# Altium schematic sheet MD015A.SchDoc
size 431 x 279 mm; Date: Not shown in title block; ApprovedBy: Not shown in title block; CheckedBy: Not shown in title block; Author: Not shown in title block; CompanyName: Not shown in title block; Engineer: Not shown in title block; Organization: Not shown in title block; Address1: Not shown in title block; Address2: Not shown in title block; Address3: Not shown in title block; Address4: Not shown in title block; DocumentNumber: 3; Revision: Use project parameter SCH_Rev; SheetNumber: 3; SheetTotal: 4; PageSetup: Record=PageOptions|CenterHorizontal=True|CenterVertical=True|PrintScale=1.00|XCorrection=1.00|YCorrection=1.00|PrintKind=0|BorderSize=5000000|LeftOffset=0|BottomOffset=0|Orientation=2|PaperLength=1000|PaperWidth=1000|Scale=100|PaperSource=15|PrintQuality=600|MediaType=1|DitherType=10|PaperKind=Letter|PrintScaleMode=1; CurrentTime: Not shown in title block; CurrentDate: Not shown in title block; Time: Not shown in title block; DocumentFullPathAndName: Not shown in title block; DocumentName: Not shown in title block; ModifiedDate: Not shown in title block; ImagePath: Not shown in title block
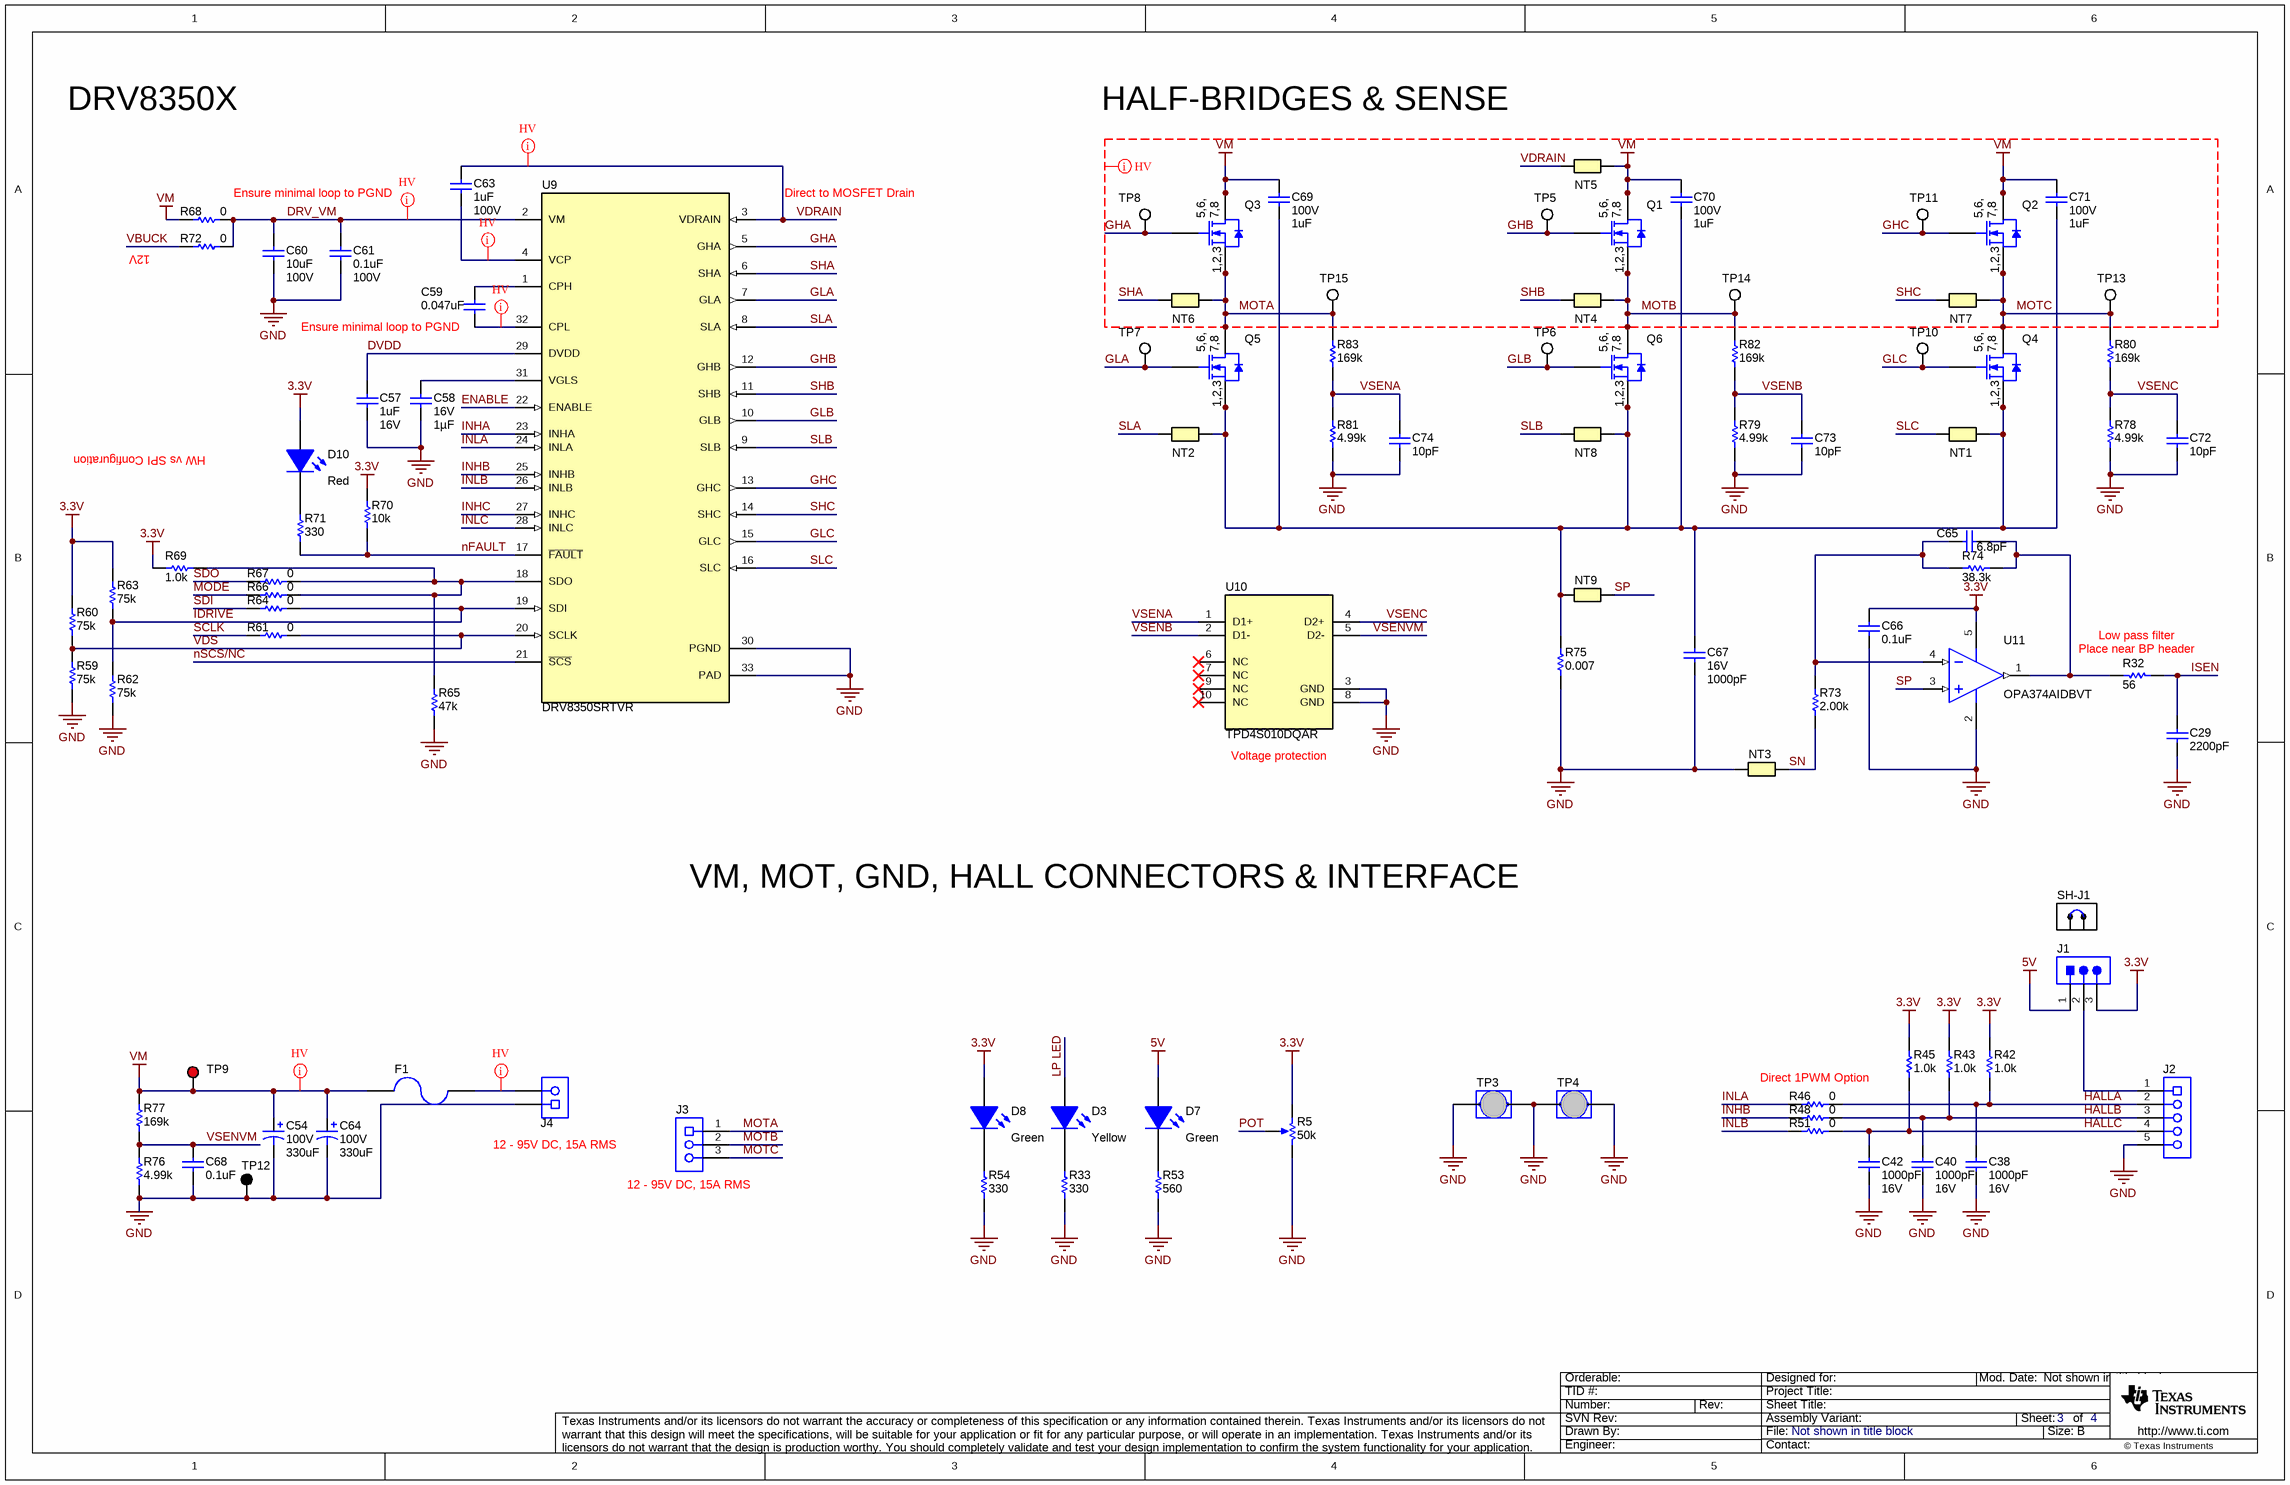
[diagram p0: MD015A.SchDoc]

## Parts
C29  ValueDisplayed: 2200pF  [0603L]  (hidden comment: GRM188R71C222KA01D)
C38  ValueDisplayed: 1000pF  VDC_V: 16V  [0603L]  (hidden comment: 885012206034)
C40  ValueDisplayed: 1000pF  VDC_V: 16V  [0603L]  (hidden comment: 885012206034)
C42  ValueDisplayed: 1000pF  VDC_V: 16V  [0603L]  (hidden comment: 885012206034)
C54  VDC_V: 100V  ValueDisplayed: 330uF  [SM_RADIAL_K16]  (hidden comment: EEV-FK2A331M)
C57  ValueDisplayed: 1uF  VDC_V: 16V  [0603L]  (hidden comment: EMK107B7105KA-T)
C58  VDC_V: 16V  ValueDisplayed: 1µF  [0603]  (hidden comment: CL10B105KO8VPNC)
C59  ValueDisplayed: 0.047uF  [0805_HV]  (hidden comment: C2012X7R2A473K125AA)
C60  ValueDisplayed: 10uF  VDC_V: 100V  [2220_280]  (hidden comment: CGA9N3X7S2A106K230KE)
C61  ValueDisplayed: 0.1uF  VDC_V: 100V  [0805]  (hidden comment: C2012X7R2A104K125AA)
C63  ValueDisplayed: 1uF  VDC_V: 100V  [1206_180L]  (hidden comment: CL31B105KCHNNNE)
C64  VDC_V: 100V  ValueDisplayed: 330uF  [SM_RADIAL_K16]  (hidden comment: EEV-FK2A331M)
C65  ValueDisplayed: 6.8pF  [0603L]  (hidden comment: 06035A6R8CAT2A)
C66  ValueDisplayed: 0.1uF  [0603L]  (hidden comment: C0603C104J4RACTU)
C67  VDC_V: 16V  ValueDisplayed: 1000pF  [0603L]  (hidden comment: 885012206034)
C68  ValueDisplayed: 0.1uF  [0603L]  (hidden comment: C0603C104J4RACTU)
C69  VDC_V: 100V  ValueDisplayed: 1uF  [1206_180]  (hidden comment: CL31B105KCHNNNE)
C70  VDC_V: 100V  ValueDisplayed: 1uF  [1206_180]  (hidden comment: CL31B105KCHNNNE)
C71  VDC_V: 100V  ValueDisplayed: 1uF  [1206_180]  (hidden comment: CL31B105KCHNNNE)
C72  ValueDisplayed: 10pF  [0603L]  (hidden comment: C0603C100F5GAC7867)
C73  ValueDisplayed: 10pF  [0603L]  (hidden comment: C0603C100F5GAC7867)
C74  ValueDisplayed: 10pF  [0603L]  (hidden comment: C0603C100F5GAC7867)
D3  value Yellow  [LED_LTST-C170]  (hidden comment: LTST-C170KSKT)
D7  value Green  [LTST-C170KGKT_Green]  (hidden comment: LTST-C170KGKT)
D8  value Green  [LTST-C170KGKT_Green]  (hidden comment: LTST-C170KGKT)
D10  value Red  [LED_LTST-C170_Red]  (hidden comment: LTST-C170KRKT)
F1  0463030.ER  [Fuse_0463]  (value not drawn)
J1  22284030  [Molex_0022284030]  (value not drawn)
J2  1792892  [Phoenix_1792892]  (value not drawn)
J3  1904150  [Phoenix_1904150]  (value not drawn)
J4  1902547  [Phoenix_1902547]  (value not drawn)
NT1  Net-Tie  [Net-Tie_20milWide_60milLong]  (value not drawn)  (net tie, no BOM)
NT2  Net-Tie  [Net-Tie_20milWide_60milLong]  (value not drawn)  (net tie, no BOM)
NT3  Net-Tie  [Net-Tie_20milWide_60milLong]  (value not drawn)  (net tie, no BOM)
NT4  Net-Tie  [Net-Tie_20milWide_60milLong]  (value not drawn)  (net tie, no BOM)
NT5  Net-Tie  [Net-Tie_50milWide_30milLong]  (value not drawn)  (net tie, no BOM)
NT6  Net-Tie  [Net-Tie_20milWide_60milLong]  (value not drawn)  (net tie, no BOM)
NT7  Net-Tie  [Net-Tie_20milWide_60milLong]  (value not drawn)  (net tie, no BOM)
NT8  Net-Tie  [Net-Tie_20milWide_60milLong]  (value not drawn)  (net tie, no BOM)
NT9  Net-Tie  [Net-Tie_20milWide_60milLong]  (value not drawn)  (net tie, no BOM)
Q1  CSD19532Q5B  [DNK0008A]  (value not drawn)
Q2  CSD19532Q5B  [DNK0008A]  (value not drawn)
Q3  CSD19532Q5B  [DNK0008A]  (value not drawn)
Q4  CSD19532Q5B  [DNK0008A]  (value not drawn)
Q5  CSD19532Q5B  [DNK0008A]  (value not drawn)
Q6  CSD19532Q5B  [DNK0008A]  (value not drawn)
R5  value 50k  [Bourns_3352T]  (hidden comment: 3352T-1-503LF)
R32  value 56  [0603L]  (hidden comment: CRCW060356R0JNEA)
R33  ValueDisplayed: 330  [0603L]  (hidden comment: CRCW0603330RJNEA)
R42  ValueDisplayed: 1.0k  [0603L]  (hidden comment: RCA06031K00JNEA)
R43  ValueDisplayed: 1.0k  [0603L]  (hidden comment: RCA06031K00JNEA)
R45  ValueDisplayed: 1.0k  [0603L]  (hidden comment: RCA06031K00JNEA)
R46  ValueDisplayed: 0  [0603L]  (hidden comment: CRCW06030000Z0EA)
R48  ValueDisplayed: 0  [0603L]  (hidden comment: CRCW06030000Z0EA)
R51  ValueDisplayed: 0  [0603L]  (hidden comment: CRCW06030000Z0EA)
R53  ValueDisplayed: 560  [0603L]  (hidden comment: RG1608P-561-B-T5)
R54  ValueDisplayed: 330  [0603L]  (hidden comment: CRCW0603330RJNEA)
R59  ValueDisplayed: 75k  [0603L]  (hidden comment: CRCW060375K0JNEA)
R60  ValueDisplayed: 75k  [0603L]  (hidden comment: CRCW060375K0JNEA)
R61  ValueDisplayed: 0  [0603L]  (hidden comment: CRCW06030000Z0EA)
R62  ValueDisplayed: 75k  [0603L]  (hidden comment: CRCW060375K0JNEA)
R63  ValueDisplayed: 75k  [0603L]  (hidden comment: CRCW060375K0JNEA)
R64  ValueDisplayed: 0  [0603L]  (hidden comment: CRCW06030000Z0EA)
R65  ValueDisplayed: 47k  [0603L]  (hidden comment: CRCW060347K0JNEA)
R66  ValueDisplayed: 0  [0603L]  (hidden comment: CRCW06030000Z0EA)
R67  ValueDisplayed: 0  [0603L]  (hidden comment: CRCW06030000Z0EA)
R68  ValueDisplayed: 0  [1206]  (hidden comment: RC1206JR-070RL)
R69  ValueDisplayed: 1.0k  [0603L]  (hidden comment: RCA06031K00JNEA)
R70  ValueDisplayed: 10k  [0603L]  (hidden comment: RC0603JR-0710KL)
R71  ValueDisplayed: 330  [0603L]  (hidden comment: CRCW0603330RJNEA)
R72  ValueDisplayed: 0  [1206]  (hidden comment: RC1206JR-070RL)
R73  ValueDisplayed: 2.00k  [0603L]  (hidden comment: RC0603FR-072KL)
R74  ValueDisplayed: 38.3k  [0603L]  (hidden comment: CRCW060338K3FKEA)
R75  ValueDisplayed: 0.007  [CRE2512-R5_R9]  (hidden comment: CRE2512-FZ-R007E-3)
R76  ValueDisplayed: 4.99k  [0603L]  (hidden comment: RC0603FR-074K99L)
R77  ValueDisplayed: 169k  [0603_HV]  (hidden comment: RC0603FR-07169KL)
R78  ValueDisplayed: 4.99k  [0603L]  (hidden comment: RC0603FR-074K99L)
R79  ValueDisplayed: 4.99k  [0603L]  (hidden comment: RC0603FR-074K99L)
R80  ValueDisplayed: 169k  [0603_HV]  (hidden comment: RC0603FR-07169KL)
R81  ValueDisplayed: 4.99k  [0603L]  (hidden comment: RC0603FR-074K99L)
R82  ValueDisplayed: 169k  [0603_HV]  (hidden comment: RC0603FR-07169KL)
R83  ValueDisplayed: 169k  [0603_HV]  (hidden comment: RC0603FR-07169KL)
SH-J1  SNT-100-BK-G  [SNT-100-BK-G]  (value not drawn)
TP3  D3082-05  [Harwin_D3082-05]  (value not drawn)
TP4  D3082-05  [Harwin_D3082-05]  (value not drawn)
TP5  5002  [Keystone5002]  (value not drawn)
TP6  5002  [Keystone5002]  (value not drawn)
TP7  5002  [Keystone5002]  (value not drawn)
TP8  5002  [Keystone5002]  (value not drawn)
TP9  5000  [Keystone5000]  (value not drawn)
TP10  5002  [Keystone5002]  (value not drawn)
TP11  5002  [Keystone5002]  (value not drawn)
TP12  5001  [Keystone5001]  (value not drawn)
TP13  5002  [Keystone5002]  (value not drawn)
TP14  5002  [Keystone5002]  (value not drawn)
TP15  5002  [Keystone5002]  (value not drawn)
U9  DRV8350SRTVR  [RTV0032E]
U10  TPD4S010DQAR  [DQA0010A]
U11  OPA374AIDBVT  [DBV0005A_L]

## Nets
3.3V: C66.1 D8.1(A) D10.1(A) J1.3 R5.3(CW) R42.2 R43.2 R45.2 R60.2 R63.2 R69.2 R70.2 U11.5(V+)
5V: D7.1(A) J1.1
GND: C29.2 C38.2 C40.2 C42.2 C54.2(-) C57.2 C58.2 C60.2 C61.2 C64.2(-) C66.2 C67.2 C68.2 C72.2 C73.2 C74.2 J2.5 J4.1 NT3.1 R5.1(CCW) R33.1 R53.1 R54.1 R59.1 R62.1 R65.1 R75.1 R76.1 R78.1 R79.1 R81.1 TP3.1 TP3.2 TP4.1 TP4.2 TP12.1 U9.30(PGND) U9.33(PAD) U10.3(GND) U10.8(GND) U11.2(V-)
VM: C54.1(+) C64.1(+) C69.1 C70.1 C71.1 F1.2 NT5.2 Q1.5(D) Q1.6(D) Q1.7(D) Q1.8(D) Q1.9(D) Q2.5(D) Q2.6(D) Q2.7(D) Q2.8(D) Q2.9(D) Q3.5(D) Q3.6(D) Q3.7(D) Q3.8(D) Q3.9(D) R68.1 R77.2 TP9.1
DRV_VM: C60.1 C61.1 R68.2 R72.2 U9.2(VM)
DVDD: C57.1 U9.29(DVDD)
ENABLE: U9.22(ENABLE)
GHA: Q3.4(G) TP8.1 U9.5(GHA)
GHB: Q1.4(G) TP5.1 U9.12(GHB)
GHC: Q2.4(G) TP11.1 U9.13(GHC)
GLA: Q5.4(G) TP7.1 U9.7(GLA)
GLB: Q6.4(G) TP6.1 U9.10(GLB)
GLC: Q4.4(G) TP10.1 U9.15(GLC)
HALLA: C38.1 J2.2 R42.1 R46.2
HALLB: C40.1 J2.3 R43.1 R48.2
HALLC: C42.1 J2.4 R45.1 R51.2
IDRIVE: R62.2 R63.1 R64.2 U9.19(SDI)
INHA: U9.23(INHA)
INHB: R48.1 U9.25(INHB)
INHC: U9.27(INHC)
INLA: R46.1 U9.24(INLA)
INLB: R51.1 U9.26(INLB)
INLC: U9.28(INLC)
ISEN: C29.1 R32.1
LP LED: D3.1(A)
MODE: R66.1
MOTA: J3.1 NT6.2 Q3.1(S) Q3.2(S) Q3.3(S) Q5.5(D) Q5.6(D) Q5.7(D) Q5.8(D) Q5.9(D) R83.2 TP15.1
MOTB: J3.2 NT4.2 Q1.1(S) Q1.2(S) Q1.3(S) Q6.5(D) Q6.6(D) Q6.7(D) Q6.8(D) Q6.9(D) R82.2 TP14.1
MOTC: J3.3 NT7.2 Q2.1(S) Q2.2(S) Q2.3(S) Q4.5(D) Q4.6(D) Q4.7(D) Q4.8(D) Q4.9(D) R80.2 TP13.1
nFAULT: R70.1 R71.1 U9.17(~{FAULT})
nSCS/NC: U9.21(~{SCS})
POT: R5.2(WIPER)
SCLK: R61.1
SDI: R64.1
SDO: R67.1
SHA: NT6.1 U9.6(SHA)
SHB: NT4.1 U9.11(SHB)
SHC: NT7.1 U9.14(SHC)
SLA: NT2.1 U9.8(SLA)
SLB: NT8.1 U9.9(SLB)
SLC: NT1.1 U9.16(SLC)
SN: NT3.2 R73.2
SP: NT9.2 U11.3(IN+)
VBUCK: R72.1
VDRAIN: C63.1 NT5.1 U9.3(VDRAIN)
VDS: R59.2 R60.1 R61.2 U9.20(SCLK)
VSENA: C74.1 R81.2 R83.1 U10.1(D1+)
VSENB: C73.1 R79.2 R82.1 U10.2(D1-)
VSENC: C72.1 R78.2 R80.1 U10.4(D2+)
VSENVM: C68.1 R76.2 R77.1 U10.5(D2-)
NetC58_1: C58.1 U9.31(VGLS)
NetC59_1: C59.1 U9.1(CPH)
NetC59_2: C59.2 U9.32(CPL)
NetC63_2: C63.2 U9.4(VCP)
NetC65_1: C65.1 R32.2 R74.1 U11.1(OUT)
NetC65_2: C65.2 R73.1 R74.2 U11.4(IN-)
NetC67_1: C67.1 C69.2 C70.2 C71.2 NT1.2 NT2.2 NT8.2 NT9.1 Q4.1(S) Q4.2(S) Q4.3(S) Q5.1(S) Q5.2(S) Q5.3(S) Q6.1(S) Q6.2(S) Q6.3(S) R75.2
NetD3_2: D3.2(K) R33.2
NetD7_2: D7.2(K) R53.2
NetD8_2: D8.2(K) R54.2
NetD10_2: D10.2(K) R71.2
NetF1_1: F1.1 J4.2
NetJ1_2: J1.2 J2.1
NetR65_2: R65.2 R66.2 R67.2 R69.1 U9.18(SDO)

Not connected (* = marked no-connect by the designer): U10 6(NC)* 7(NC)* 9(NC)* 10(NC)*

## Layout directives
net class HV: DRV_VM, GHA, GHB, GHC, MOTA, MOTB, MOTC, NetC59_2, NetC63_2, NetF1_1, SHA, SHB, SHC, VDRAIN, VM

## Notes on the sheet
- DRV8350X
- HALF-BRIDGES & SENSE
- (near R68) Ensure minimal loop to PGND
- Direct to MOSFET Drain
- 12V
- (near C59) Ensure minimal loop to PGND
- HW vs SPI Configuration
- (near R32) Low pass filter
- (near R32) Place near BP header
- (near U10) Voltage protection
- VM, MOT, GND, HALL CONNECTORS & INTERFACE
- Direct 1PWM Option
- (near J4) 12 - 95V DC, 15A RMS
- (near J3) 12 - 95V DC, 15A RMS
- Drawn By:
- SVN Rev:
- Number:
- TID #:
- Orderable:
- Rev:
- Sheet Title:
- File:
- Project Title:
- Designed for:
- Assembly Variant:
- Mod. Date:
- Sheet:
- Size:
- of
- B
- http://www.ti.com
- Texas Instruments and/or its licensors do not warrant the accuracy or completeness of this specification or any information contained therein. Texas Instruments and/or its licensors do not warrant that this design will meet the specifications, will be suitable for your application or fit for any particular purpose, or will operate in an implementation. Texas Instruments and/or its licensors do not warrant that the design is production worthy. You should completely validate and test your design implementation to confirm the system functionality for your application.
- Engineer:
- Contact:
- © Texas Instruments
- (in symbol CMP-0000958-3) 5,6,; 7,8; 1,2,3

## Library data of the parts
C29 = CMP-0007387-4: CAP, CERM, 2200 pF, 16 V, +/- 10%, X7R, 0603; Manufacturer: MuRata; Polarized: N; Value: 2200pF; U/M: EA; Cap_F: 2.2nF; Value1: Unknown; VDC_V: 16V; TaMin_C: -55°C; TaMax_C: 125°C; Cap_Case: 0603; SizeArea_mm2: 1.28; SizeAreaWB_mm2: 4.68; SizeX_mm: 1.6; SizeY_mm: 0.8; SizeZ_mm: 1; AEC Category: Q200; CompType: Capacitor; PartNumber: GRM188R71C222KA01D; PackageReference: 0603; RoHS: Y; Tolerance_%: 10%; Value2: 16V; MountType: SMT; Technology: Ceramic; TempCo: X7R; Published: 2008-06-19; Publisher: Texas Instruments; LatestRevisionDate: 2017-03-09; ComponentLink1Description: Datasheet link; ComponentLink1URL: http://search.murata.co.jp/Ceramy/PnsearchViewAction.do?HnOFG=ON&HnNFG=ON&SEL_CNT=50&sLang=en&sKey=GRM188R71C222KA01D&x=9&y=9&search=startwith; Supplier 1: Digi-Key; Supplier Part Number 1: GRM188R71C222KA01D-ND; Supplier 2: Mouser; Supplier Part Number 2: 81-GRM188R71C222KA1D; AEC Qualified: ?
C38 C40 C42 C67 = CMP-0006826-4: CAP, CERM, 1000 pF, 16 V, +/- 10%, X7R, 0603; Manufacturer: Wurth Elektronik; TaMin_C: -55°C; Polarized: N; SizeAreaWB_mm2: 4.68; Value1: Unknown; U/M: EA; Value: 1000pF; TaMax_C: 125°C; SizeZ_mm: 1; SizeX_mm: 1.6; SizeY_mm: 0.8; Cap_Case: 0603; SizeArea_mm2: 1.28; Cap_F: 1nF; AEC Category: Q200; Publisher: Texas Instruments; TempCo: X7R; Published: 2008-06-19; RoHS: Y; MountType: SMT; Supplier 1: Mouser; PackageReference: 0603; Tolerance_%: 10%; Value2: 16V; CompType: Capacitor; LatestRevisionDate: 2017-03-09; PartNumber: 885012206034; AEC Qualified: N; ComponentLink1Description: Datasheet link; AEC Grade: N/A; Supplier Part Number 1: 710-885012206034; Technology: Ceramic; ComponentLink1URL: http://katalog.we-online.de/pbs/datasheet/885012206034.pdf
C54 C64 = CMP-0011224-2: CAP, AL, 330 uF, 100 V, +/- 20%, 0.153 ohm, AEC-Q200 Grade 2, SMD; Manufacturer: Panasonic; TaMin_C: -55°C; ESR_ohm: 0.153; Polarized: Y; SizeAreaWB_mm2: 483; U/M: EA; Value: 330uF; TaMax_C: 105°C; SizeZ_mm: 16.5; SizeX_mm: 21; SizeY_mm: 19; Cap_Case: K16; SizeArea_mm2: 399; CompType: Capacitor; Cap_F: 330µF; IRMS_A: 917mA; AEC Grade: 2; AEC Category: Q200; Supplier Part Number 2: 667-EEV-FK2A331M; Publisher: Texas Instruments; Supplier 2: Mouser; RoHS: Y; Value1: 0.153 ohm; MountType: SMT; Supplier 1: Digi-Key; PackageReference: SMT Radial K16; Tolerance_%: 20%; Value2: 100V; LatestRevisionDate: 2017-03-09; PartNumber: EEV-FK2A331M; AEC Qualified: Y; Series: FK; ComponentLink1Description: Datasheet link; Supplier Part Number 1: PCE3505CT-ND; Technology: AL; ComponentLink1URL: https://industrial.panasonic.com/cdbs/www-data/pdf/RDE0000/ABA0000C1181.pdf
C57 = CMP-0007120-4: CAP, CERM, 1 uF, 16 V, +/- 10%, X7R, 0603; Manufacturer: Taiyo Yuden; TaMin_C: -55°C; Polarized: N; SizeAreaWB_mm2: 4.68; Value1: Unknown; U/M: EA; Value: 1uF; TaMax_C: 85°C; SizeZ_mm: 1; SizeX_mm: 1.6; SizeY_mm: 0.8; Cap_Case: 0603; SizeArea_mm2: 1.28; Cap_F: 1µF; AEC Category: Q200; Publisher: Texas Instruments; TempCo: X7R; Published: 2008-06-19; RoHS: Y; MountType: SMT; Supplier 1: Farnell; PackageReference: 0603; Tolerance_%: 10%; Value2: 16V; CompType: Capacitor; LatestRevisionDate: 2017-03-09; PartNumber: EMK107B7105KA-T; AEC Qualified: ?; ComponentLink1Description: Datasheet link; Supplier Part Number 1: 1683647; Technology: Ceramic; ComponentLink1URL: http://www.yuden.co.jp/ut/product/pdf/djmk_e.pdf
C58 = CMP-0085302-1: CAP, CERM, 1 µF, 16 V,+/- 10%, X7R, AEC-Q200 Grade 1, 0603; Manufacturer: Samsung Electro-Mechanics; TaMax_C: 125°C; AEC Grade: 1; SizeAreaWB_mm2: 4.68; AEC Category: Q200; SizeY_mm: 0.8; U/M: EA; SizeArea_mm2: 1.28; TaMin_C: -55°C; Value: 1uF; SizeX_mm: 1.6; AEC Qualified: Y; Polarized: N; PartNumber: CL10B105KO8VPNC; Tolerance_%: 10%; PackageReference: 0603; Value2: 16V; MountType: SMT; ComponentLink1URL: http://www.samsungsem.com/kr/support/product-search/mlcc/__icsFiles/afieldfile/2018/05/28/CL10B105KO8VPNC.pdf; SizeZ_mm: 1; Technology: Ceramic; Cap_Case: 0603; Cap_F: 1µF; CompType: Capacitor; RoHS: Y; ComponentLink1Description: Datasheet link; TempCo: X7R
C59 = CMP-0007887-2: CAP, CERM, 0.047 uF, 100 V, +/- 10%, X7R, 0805; Manufacturer: TDK; Polarized: N; U/M: EA; Cap_F: 47nF; ESR_ohm: 0.049089; Value1: 0.049089 ohm; VDC_V: 100V; IRMS_A: 963.171mA; TaMin_C: -55°C; TaMax_C: 125°C; Cap_Case: 0805; AEC Category: Q200; SizeArea_mm2: 2.5; SizeAreaWB_mm2: 6.75; SizeX_mm: 2; SizeY_mm: 1.25; SizeZ_mm: 1.45; CompType: Capacitor; Value: 0.047uF; PartNumber: C2012X7R2A473K125AA; PackageReference: 0805; RoHS: Y; Tolerance_%: 10%; Value2: 100V; MountType: SMT; Technology: Ceramic; TempCo: X7R; Published: 2008-06-19; Publisher: Texas Instruments; LatestRevisionDate: 2017-03-09; ComponentLink1Description: Datasheet link; ComponentLink1URL: https://product.tdk.com/en/search/capacitor/ceramic/mlcc/info?part_no=C2012X7R2A473K125AA; Supplier 1: Digi-Key; Supplier Part Number 1: 445-2276-1-ND; Supplier 2: Mouser; Supplier Part Number 2: 810-C2012X7R2A473K125AA; AEC Qualified: N; AEC Grade: N/A
C60 = CMP-0064964-2: CAP, CERM, 10 uF, 100 V,+/- 10%, X7S, AEC-Q200 Grade 1, 2220; Manufacturer: TDK; TaMin_C: -55°C; Polarized: N; SizeAreaWB_mm2: 53.9; Value1: Unknown; U/M: EA; Value: 10uF; TaMax_C: 125°C; SizeZ_mm: 2.8; SizeX_mm: 5.7; SizeY_mm: 5; Cap_Case: 2220; SizeArea_mm2: 28.5; AEC Qualified: Y; Cap_F: 10µF; AEC Grade: 1; AEC Category: Q200; Supplier Part Number 2: 80X3234; Publisher: Texas Instruments; Supplier 2: Newark; Supplier Part Number 3: 810-CGA9N3X7S2A106KS; TempCo: X7S; Supplier 3: Mouser; Published: 2008-06-19; RoHS: Y; MountType: SMT; Supplier 1: Digi-Key; PackageReference: 2220; Tolerance_%: 10%; Value2: 100V; CompType: Capacitor; LatestRevisionDate: 2017-06-05; PartNumber: CGA9N3X7S2A106K230KE; ComponentLink1Description: Datasheet link; Supplier Part Number 1: 445-8768-1-ND; Technology: Ceramic; ComponentLink1URL: https://product.tdk.com/info/en/catalog/datasheets/mlcc_automotive_soft_en.pdf
C61 = CMP-0007886-2: CAP, CERM, 0.1 uF, 100 V, +/- 10%, X7R, 0805; Manufacturer: TDK; TaMin_C: -55°C; ESR_ohm: 0.020726; Polarized: N; SizeAreaWB_mm2: 6.75; Value1: 0.020726 ohm; U/M: EA; Value: 0.1uF; TaMax_C: 125°C; SizeZ_mm: 1.45; SizeX_mm: 2; SizeY_mm: 1.25; SizeArea_mm2: 2.5; Cap_F: 100nF; IRMS_A: 1.456A; AEC Category: Q200; Supplier Part Number 2: 1844410; Publisher: Texas Instruments; Supplier 2: Farnell; TempCo: X7R; Published: 2008-06-19; RoHS: Y; MountType: SMT; Supplier 1: Digi-Key; PackageReference: 0805; Tolerance_%: 10%; Cap_Case: 0805; Value2: 100V; CompType: Capacitor; LatestRevisionDate: 2017-03-09; PartNumber: C2012X7R2A104K125AA; AEC Qualified: N; ComponentLink1Description: Datasheet link; AEC Grade: N/A; Supplier Part Number 1: 445-1418-1-ND; Technology: Ceramic; ComponentLink1URL: https://product.tdk.com/en/search/capacitor/ceramic/mlcc/info?part_no=C2012X7R2A104K125AA
C63 C69-C71 = CMP-0008801-2: CAP, CERM, 1 uF, 100 V, +/- 10%, X7R, 1206; Manufacturer: Samsung; TaMin_C: -55°C; Polarized: N; SizeAreaWB_mm2: 10.92; Value1: Unknown; U/M: EA; Value: 1uF; TaMax_C: 125°C; SizeZ_mm: 1.8; SizeX_mm: 3.2; SizeY_mm: 1.6; Cap_Case: 1206; SizeArea_mm2: 5.12; Cap_F: 1µF; AEC Category: Q200; Publisher: Texas Instruments; TempCo: X7R; Published: 2008-06-19; RoHS: Y; MountType: SMT; Supplier 1: Digi-Key; PackageReference: 1206; Tolerance_%: 10%; Value2: 100V; CompType: Capacitor; LatestRevisionDate: 2017-03-09; PartNumber: CL31B105KCHNNNE; AEC Qualified: N; ComponentLink1Description: Datasheet link; AEC Grade: N/A; Supplier Part Number 1: 1276-1838-1-ND; Technology: Ceramic; ComponentLink1URL: http://www.samsungsem.com/kr/front/downloadcms.do?path=/kr/support/product-search/mlcc/__icsFiles/afieldfile/2014/11/05&fileName=C_CL31B105KCHNNNE.pdf
C65 = CMP-0006798-4: CAP, CERM, 6.8 pF, 50 V, +/- 4%, C0G/NP0, 0603; Manufacturer: AVX; Polarized: N; Value: 6.8pF; U/M: EA; ESR_ohm: 0.505; Value1: 0.505 ohm; VDC_V: 50V; TaMin_C: -55°C; TaMax_C: 125°C; Cap_Case: 0603; SizeArea_mm2: 1.28; SizeAreaWB_mm2: 4.68; SizeX_mm: 1.6; SizeY_mm: 0.8; SizeZ_mm: 1; AEC Category: Q200; CompType: Capacitor; PartNumber: 06035A6R8CAT2A; PackageReference: 0603; RoHS: Y; Cap_F: 6.8pF; Tolerance_%: 4%; Value2: 50V; MountType: SMT; Technology: Ceramic; TempCo: C0G/NP0; Published: 2008-06-19; Publisher: Texas Instruments; LatestRevisionDate: 2017-03-09; ComponentLink1Description: Datasheet link; ComponentLink1URL: http://datasheets.avx.com/C0GNP0-Dielectric.pdf; Supplier 1: Digi-Key; Supplier Part Number 1: 478-1161-1-ND; Supplier 2: Mouser; Supplier Part Number 2: 581-06035A6R8CAT2A; Supplier 3: Farnell; Supplier Part Number 3: 1396258; AEC Qualified: N; AEC Grade: N/A
C66 C68 = CMP-0006857-4: CAP, CERM, 0.1 uF, 16 V, +/- 5%, X7R, 0603; Manufacturer: Kemet; Polarized: N; Value: 0.1uF; U/M: EA; Cap_F: 100nF; Value1: Unknown; VDC_V: 16V; TaMin_C: -55°C; TaMax_C: 125°C; Cap_Case: 0603; AEC Category: Q200; SizeArea_mm2: 1.28; SizeAreaWB_mm2: 4.68; SizeX_mm: 1.6; SizeY_mm: 0.8; SizeZ_mm: 1; CompType: Capacitor; PartNumber: C0603C104J4RACTU; PackageReference: 0603; RoHS: Y; Tolerance_%: 5%; Value2: 16V; MountType: SMT; Technology: Ceramic; TempCo: X7R; Published: 2008-06-19; Publisher: Texas Instruments; LatestRevisionDate: 2017-03-09; ComponentLink1Description: Datasheet link; ComponentLink1URL: http://www.kemet.com/kemet/web/homepage/kechome.nsf/vapubfiles/F3102_Y5V.pdf/$file/F3102_Y5V.pdf; Supplier 1: Digi-Key; Supplier Part Number 1: 399-1097-1-ND; Supplier 2: Mouser; Supplier Part Number 2: 80-C0603C104J4R; Supplier 3: Farnell; Supplier Part Number 3: 1650834; AEC Qualified: ?
C72-C74 = CMP-0006838-4: CAP, CERM, 10 pF, 50 V, +/- 1%, C0G/NP0, 0603; Manufacturer: Kemet; Polarized: N; Value: 10pF; U/M: EA; Value1: Unknown; VDC_V: 50V; TaMin_C: -55°C; TaMax_C: 125°C; Cap_Case: 0603; SizeArea_mm2: 1.28; SizeAreaWB_mm2: 4.68; SizeX_mm: 1.6; SizeY_mm: 0.8; SizeZ_mm: 1; AEC Category: Q200; CompType: Capacitor; PartNumber: C0603C100F5GAC7867; PackageReference: 0603; RoHS: Y; Cap_F: 10pF; Tolerance_%: 1%; Value2: 50V; MountType: SMT; Technology: Ceramic; TempCo: C0G/NP0; Published: 2008-06-19; Publisher: Texas Instruments; LatestRevisionDate: 2017-03-09; ComponentLink1Description: Datasheet link; ComponentLink1URL: http://capacitoredge.kemet.com/capedge2/DataSheet/Datasheet-C0603C100F5GACTU.pdf?pn=C0603C100F5GACTU; Supplier 1: Digi-Key; Supplier Part Number 1: 399-9958-1-ND; AEC Qualified: N; AEC Grade: N/A
D3 = CMP-0002862-2: LED, Yellow , SMD; Manufacturer: Lite-On; SizeY_mm: 1.25; SizeZ_mm: 1.2; SizeX_mm: 2; Vf_V: 2V; Type: AlInGaP; SizeAreaWB_mm2: 6.75; Value1: W; Io_A: 20mA; SizeArea_mm2: 2.5; Color: yellow; ComponentLink1URL: http://optoelectronics.liteon.com/upload/download/DS-22-99-0188/P_100_LTST-C170KSKT.pdf; PartNumber: LTST-C170KSKT; RoHS: Y; ComponentLink1Description: Datasheet link; MountType: SMT; PackageReference: 0805 LED; Value2: 2V; CompType: LED
D7 D8 = CMP-0002888-2: LED, Green, SMD; Manufacturer: Lite-On; Value1: W; Vf_V: 2V; Type: AlInGaP; Io_A: 20mA; MountType: SMT; Color: Green; ComponentLink1URL: http://optoelectronics.liteon.com/upload/download/DS22-2000-073/S_110_LTST-C170KGKT.pdf; RoHS: Y; PackageReference: LED_0805; ComponentLink1Description: Datasheet link; PartNumber: LTST-C170KGKT; Value2: 2V; CompType: LED
D10 = CMP-0002829-3: LED, Red, SMD; Manufacturer: Lite-On; SizeZ_mm: 1.2; Value1: W; SizeY_mm: 1.25; Value2: 2V; SizeArea_mm2: 2.5; SizeX_mm: 2; SizeAreaWB_mm2: 6.75; Io_A: 20mA; Type: AlInGaP; PartNumber: LTST-C170KRKT; MountType: SMT; PackageReference: Red 0805 LED; ComponentLink1Description: Datasheet link; RoHS: Y; CompType: LED; ComponentLink1URL: http://optoelectronics.liteon.com/upload/download/DS-22-99-0150/P_100_LTST-C170KRKT.pdf; Color: red; Vf_V: 2V
F1 = CMP-0077200-3: Fuse, 30 A, 250 VAC, 100 VDC, SMD; Manufacturer: Littelfuse; VAC_V: 250V; SizeAreaWB_mm2: 61.952; Rtyp_Ohm: 1.93m; SizeArea_mm2: 31.512; MeltingTyp: 916; Irating_A: 30A; SizeZ_mm: 3.12; VDC_V: 100V; SizeX_mm: 10.1; Interrupt_AC: 100A; Interrupt_DC: 50A; Fuse Speed: Fast; Fuse Technology: Board Mount; TaMax_C: 125°C; TaMin_C: -55°C; ComponentLink1Description: Datasheet URL; RoHS: Y; Supplier Part Number 3: 576-0463030.ER; Supplier 1: Digi-Key; PackageReference: 10.1x3.12mm; PartNumber: 0463030.ER; Supplier Part Number 2: 64W8551; Supplier 2: Newark; SizeY_mm: 3.12; ComponentLink1URL: http://www.littelfuse.com/~/media/electronics/datasheets/fuses/littelfuse_fuse_463_datasheet.pdf.pdf; CompType: Fuse; MountType: SMT; Supplier Part Number 1: F6439CT-ND; Supplier 3: Mouser
J1 = CMP-0078237-1: Header, 2.54mm, 3x1, Tin, TH; Manufacturer: Molex; Pitch_mm: 2.54; Gender: Male; Cert_CSA: Y; Current_A: 4A; Voltage_V: 500V; Shrouded: N; Row_Count: 1; ComponentLink1Description: Datasheet URL; RoHS: Y; Supplier Part Number 3: 538-22-28-4030; Supplier 1: Digi-Key; Cert_UL: Y; Orientation: Vertical; PackageReference: Header, 2.54mm, 3x1, Tin, TH; Color: Black; PartNumber: 22284030; PinCount: 3; Supplier Part Number 2: 56H1960; ContactFinish: Tin; Supplier 2: Newark; ClassName: Header; ComponentLink1URL: http://www.molex.com/pdm_docs/sd/022284030_sd.pdf; CompType: Header; MountType: TH; Supplier Part Number 1: WM50014-03-ND; Supplier 3: Mouser
J2 = CMP-0055532-1: Terminal Block, 5mm, 5x1, R/A, TH; Manufacturer: Phoenix Contact; Cert_VDE: Y; CNHeader: FALSE; Current_A: 16A; Gender: Female; Voltage_V: 400V; Row_Count: 1; Pitch_mm: 5; CT: TRUE; ComponentLink1URL: https://www.phoenixcontact.com/online/portal/pi?uri=pxc-oc-itemdetail:pid=1792892&library=pien&pcck=P-11-01-05&tab=1; Supplier Part Number 2: 78T0423; Publisher: Texas Instruments; Supplier 2: Newark; Supplier Part Number 3: 651-1792892; Color: Green; Supplier 3: Mouser; Cert_CULUS: Y; RoHS: Y; MountType: TH; Supplier 1: Digi-Key; PackageReference: Terminal Block, 5mm, 5x1, R/A, TH; PinCount: 5; CompType: Terminal Block; LatestRevisionDate: 26/05/2017; PartNumber: 1792892; Orientation: R/A; ComponentLink1Description: Datasheet URL; Supplier Part Number 1: 277-2521-ND; Cert_UL: Y
J3 = CMP-0055528-1: Terminal Block, 9.52mm, 3x1, R/A, TH; Manufacturer: Phoenix Contact; Pitch_mm: 9.52; Gender: Female; Row_Count: 1; Current_A: 32A; Voltage_V: 1kV; Cert_UL: Y; CNHeader: FALSE; CT: TRUE; PartNumber: 1904150; PackageReference: Terminal Block, 3x1, Pitch 9.52mm; CompType: Terminal Block; RoHS: Y; MountType: TH; ComponentLink1Description: Datasheet URL; ComponentLink1URL: https://www.phoenixcontact.com/online/portal/in?uri=pxc-oc-itemdetail:pid=1904150&library=inen&pcck=P-11-01-05&tab=1; Publisher: Texas Instruments; LatestRevisionDate: 26/05/2017; Supplier 1: Digi-Key; Supplier Part Number 1: 277-6184-ND; Supplier 2: Newark; Supplier Part Number 2: 15X2516; Supplier 3: Mouser; Supplier Part Number 3: 651-1904150; Orientation: R/A; PinCount: 3; Color: Green; Cert_VDE: Y
J4 = CMP-0055527-1: Terminal Block, 9.52mm, 2x1, R/A, TH; Manufacturer: Phoenix Contact; Pitch_mm: 9.52; Gender: Female; Row_Count: 1; Current_A: 32A; Voltage_V: 1kV; Cert_UL: Y; CNHeader: FALSE; CT: TRUE; PartNumber: 1902547; PackageReference: Terminal Block, 2x1, Pitch 9.52mm; CompType: Terminal Block; RoHS: Y; MountType: TH; ComponentLink1Description: Datasheet URL; ComponentLink1URL: https://www.phoenixcontact.com/online/portal/in?uri=pxc-oc-itemdetail:pid=1902547&library=inen&tab=1&requestType=product&product; Publisher: Texas Instruments; LatestRevisionDate: 26/05/2017; Supplier 1: Digi-Key; Supplier Part Number 1: 277-5951-ND; Supplier 2: Mouser; Supplier Part Number 2: 651-1902547; Orientation: R/A; PinCount: 2; Color: Green; Cert_VDE: Y
NT1-NT9 = CMP-0078142-2: Single point connection between nets.; MountType: SMT; PackageReference: N/A; CompType: Net-Tie; Manufacturer: N/A; PartNumber: N/A; Library Reference: Net-Tie
Q1-Q6 = CMP-0000958-3: MOSFET, N-CH, 100 V, 17 A, DNK0008A (VSON-CLIP-8); Manufacturer: Texas Instruments; Alternate Manufacturer: None; U/M: EA; ChType: N; Value: 100V; Value2: 48 nC; QgTyp_nC: 48; Vgs_V: 20V; IdsMax_A: 17A; SizeAreaWB_mm2: 56; SizeArea_mm2: 30; SizeX_mm: 6; SizeY_mm: 5; SizeZ_mm: 1; AEC Category: Q101; CompType: MOSFET; PartNumber: CSD19532Q5B; PackageReference: DNK0008A; VdsMax_V: 100V; RoHS: Y; MountType: SMT; ComponentLink1Description: Datasheet link; ComponentLink1URL: http://www.ti.com/lit/ds/symlink/csd19532q5b.pdf; Supplier 1: Digi-Key; Supplier Part Number 1: 296-37478-6-ND; Supplier 2: Farnell; Supplier Part Number 2: 2413268; AEC Qualified: N
R5 = CMP-0001777-2: Trimming Potentiometer, 50K, 0.5W, TH; Manufacturer: Bourns; CompType: Trimmer; PartNumber: 3352T-1-503LF; MountType: TH; ComponentLink1Description: Datasheet URL; ComponentLink1URL: http://www.bourns.com/data/global/PDFs/3352.pdf; RoHS: Y; PackageReference: 9.53x8.89mm; Publisher: Texas Instruments; LatestRevisionDate: 09/03/2017; Supplier 1: Digi-Key; Supplier Part Number 1: 3352T-503LF-ND; Supplier 2: Newark; Supplier Part Number 2: 32K8175; Supplier 3: Mouser; Supplier Part Number 3: 652-3352T-1-503LF
R32 = CMP-0025829-4: RES, 56, 5%, 0.1 W, AEC-Q200 Grade 0, 0603; Manufacturer: Vishay-Dale; Value_Code: 56R0; Power_W: 100mW; Value2: 0.1W; VDC_V: 75V; TempCo: 200 ppm/C; EIA_Code: E24; AEC Category: Q200; AEC Qualified: Y; AEC Grade: 0; SizeArea_mm2: 1.28; SizeX_mm: 1.6; SizeY_mm: 0.8; SizeZ_mm: 1; CompType: Resistor; PartNumber: CRCW060356R0JNEA; PackageReference: 0603; RoHS: E; Res_ohm: 56; Tolerance_%: 5%; Value1: 5%; MountType: SMT; Technology: Thick Film; ComponentLink1Description: Datasheet link; ComponentLink1URL: http://www.vishay.com/docs/20035/dcrcwe3.pdf; Supplier 1: Digi-Key; Supplier Part Number 1: 541-56GCT-ND; Supplier 2: Newark; Supplier Part Number 2: 59M6825; Supplier 3: Mouser; Supplier Part Number 3: 71-CRCW0603J-56-E3; ValueDisplayed: 56
R33 R54 R71 = CMP-0025785-4: RES, 330, 5%, 0.1 W, AEC-Q200 Grade 0, 0603; Manufacturer: Vishay-Dale; Power_W: 100mW; TempCo: 200 ppm/C; Value_Code: 330R; Value: 330; EIA_Code: E24; SizeX_mm: 1.6; SizeY_mm: 0.8; SizeZ_mm: 1; Value2: 0.1W; SizeArea_mm2: 1.28; AEC Qualified: Y; VDC_V: 75V; AEC Category: Q200; AEC Grade: 0; ComponentLink1URL: http://www.vishay.com/docs/20035/dcrcwe3.pdf; Supplier Part Number 2: 59M6805; Supplier 2: Newark; Supplier Part Number 3: 71-CRCW0603J-330-E3; Supplier 3: Mouser; RoHS: E; Value1: 5%; MountType: SMT; Supplier 1: Digi-Key; PackageReference: 0603; Tolerance_%: 5%; Res_ohm: 330; CompType: Resistor; PartNumber: CRCW0603330RJNEA; ComponentLink1Description: Datasheet link; Supplier Part Number 1: 541-330GCT-ND; Technology: Thick Film
R42 R43 R45 R69 = CMP-0025946-3: RES, 1.0 k, 5%, 0.1 W, AEC-Q200 Grade 0, 0603; Manufacturer: Vishay-Dale; Power_W: 100mW; TempCo: 200 ppm/C; Value_Code: 1k00; U/M: EA; Value: 1.0k; EIA_Code: E24; Res_ohm: 1k; SizeX_mm: 1.6; SizeY_mm: 0.8; SizeZ_mm: 1; Value2: 0.1W; SizeArea_mm2: 1.28; AEC Qualified: Y; VDC_V: 75V; AEC Grade: 0; AEC Category: Q200; Supplier Part Number 2: 19T6578; Publisher: Texas Instruments; Supplier 2: Newark; Published: 2008-06-26; RoHS: Y; Value1: 5%; MountType: SMT; Supplier 1: Digi-Key; PackageReference: 0603; Tolerance_%: 5%; CompType: Resistor; LatestRevisionDate: 2017-03-09; PartNumber: RCA06031K00JNEA; ComponentLink1Description: Datasheet link; Supplier Part Number 1: 541-2213-1-ND; Technology: Thick Film; ComponentLink1URL: http://www.vishay.com/docs/20037/rcae3.pdf
R46 R48 R51 R61 R64 R66 R67 = CMP-0025697-4: RES, 0, 5%, 0.1 W, AEC-Q200 Grade 0, 0603; Manufacturer: Vishay-Dale; Power_W: 100mW; TempCo: 200 ppm/C; Value_Code: 0000; Value: 0; EIA_Code: E24; SizeX_mm: 1.6; SizeY_mm: 0.8; SizeZ_mm: 1; Value2: 0.1W; SizeArea_mm2: 1.28; AEC Qualified: Y; VDC_V: 75V; AEC Category: Q200; ComponentLink1URL: http://www.vishay.com/docs/20035/dcrcwe3.pdf; Supplier Part Number 2: 52K8014; Supplier 2: Newark; Supplier Part Number 3: 71-CRCW0603-0-E3; Supplier 3: Mouser; RoHS: E; Value1: 5%; MountType: SMT; Supplier 1: Digi-Key; PackageReference: 0603; Tolerance_%: 5%; Res_ohm: 0; CompType: Resistor; PartNumber: CRCW06030000Z0EA; ComponentLink1Description: Datasheet link; Supplier Part Number 1: 541-0.0GCT-ND; Technology: Thick Film; AEC Grade: 0
R53 = CMP-0023573-3: RES, 560, 0.1%, 0.1 W, 0603; Manufacturer: Susumu Co Ltd; Power_W: 100mW; TempCo: 25 ppm/C; Value_Code: 560R; U/M: EA; Value: 560; SizeX_mm: 1.6; SizeY_mm: 0.8; SizeZ_mm: 1; Value2: 0.1W; SizeArea_mm2: 1.28; VDC_V: 75V; AEC Category: Q200; ComponentLink1URL: http://www.susumu.co.jp/english/pdf/products-j01-01.pdf; Supplier Part Number 2: 754-RG1608P-561-BT5; Publisher: Texas Instruments; Supplier 2: Mouser; Published: 2008-06-26; RoHS: Y; Value1: 0.1%; MountType: SMT; Supplier 1: Digi-Key; PackageReference: 0603; Tolerance_%: 0.1%; Res_ohm: 560; CompType: Resistor; LatestRevisionDate: 2017-03-09; PartNumber: RG1608P-561-B-T5; AEC Qualified: ?; ComponentLink1Description: Datasheet link; Supplier Part Number 1: RG16P560BCT-ND; Technology: Metal Film
R59 R60 R62 R63 = CMP-0025853-4: RES, 75 k, 5%, 0.1 W, AEC-Q200 Grade 0, 0603; Manufacturer: Vishay-Dale; Value: 75k; Value_Code: 75k0; Power_W: 100mW; Value2: 0.1W; VDC_V: 75V; TempCo: 200 ppm/C; EIA_Code: E24; AEC Category: Q200; AEC Qualified: Y; AEC Grade: 0; SizeArea_mm2: 1.28; SizeX_mm: 1.6; SizeY_mm: 0.8; SizeZ_mm: 1; CompType: Resistor; PartNumber: CRCW060375K0JNEA; PackageReference: 0603; RoHS: E; Res_ohm: 75k; Tolerance_%: 5%; Value1: 5%; MountType: SMT; Technology: Thick Film; ComponentLink1Description: Datasheet link; ComponentLink1URL: http://www.vishay.com/docs/20035/dcrcwe3.pdf; Supplier 1: Digi-Key; Supplier Part Number 1: 541-75KGCT-ND; Supplier 2: Newark; Supplier Part Number 2: 89M6790; Supplier 3: Mouser; Supplier Part Number 3: 71-CRCW0603J-75K-E3
R65 = CMP-0025814-4: RES, 47 k, 5%, 0.1 W, AEC-Q200 Grade 0, 0603; Manufacturer: Vishay-Dale; Value: 47k; Value_Code: 47k0; Power_W: 100mW; Value2: 0.1W; VDC_V: 75V; TempCo: 200 ppm/C; EIA_Code: E24; AEC Category: Q200; AEC Qualified: Y; AEC Grade: 0; SizeArea_mm2: 1.28; SizeX_mm: 1.6; SizeY_mm: 0.8; SizeZ_mm: 1; CompType: Resistor; PartNumber: CRCW060347K0JNEA; PackageReference: 0603; RoHS: E; Res_ohm: 47k; Tolerance_%: 5%; Value1: 5%; MountType: SMT; Technology: Thick Film; ComponentLink1Description: Datasheet link; ComponentLink1URL: http://www.vishay.com/docs/20035/dcrcwe3.pdf; Supplier 1: Digi-Key; Supplier Part Number 1: 541-47KGCT-ND; Supplier 2: Newark; Supplier Part Number 2: 59M6815; Supplier 3: Mouser; Supplier Part Number 3: 71-CRCW060347K0JNEA
R68 R72 = CMP-0018759-2: RES, 0, 5%, 0.25 W, 1206; Manufacturer: Yageo America; Power_W: 250mW; TempCo: 200 ppm/C; Value_Code: 0000; U/M: EA; Value: 0; EIA_Code: E24; SizeX_mm: 3.2; SizeY_mm: 1.6; SizeZ_mm: 1.35; Value2: 0.25W; SizeArea_mm2: 5.12; VDC_V: 200V; AEC Category: Q200; Supplier Part Number 2: 603-RC1206JR-070RL; Publisher: Texas Instruments; Supplier 2: Mouser; Supplier Part Number 3: 9240276; Supplier 3: Farnell; Published: 2008-06-26; RoHS: Y; Value1: 5%; MountType: SMT; Supplier 1: Digi-Key; PackageReference: 1206; Tolerance_%: 5%; Res_ohm: 0; CompType: Resistor; LatestRevisionDate: 2017-03-09; PartNumber: RC1206JR-070RL; AEC Qualified: ?; ComponentLink1Description: Datasheet link; Supplier Part Number 1: 311-0.0ERCT-ND; Technology: Thick Film; ComponentLink1URL: http://www.yageo.com/pdf/Pu-RC1206_51_PbFree_L_2.pdf
R70 = CMP-0025886-5: RES, 10 k, 5%, 0.1 W, 0603; Manufacturer: Yageo; Power_W: 100mW; TempCo: 100 ppm/C; Value_Code: 10k0; Value: 10k; EIA_Code: E24; SizeX_mm: 1.6; SizeY_mm: 0.8; SizeZ_mm: 1; Value2: 0.1W; SizeArea_mm2: 1.28; AEC Qualified: N; VDC_V: 75V; AEC Category: Q200; SizeAreaWB_mm2: 4.68; Supplier Part Number 2: 603-RC0603JR-0710KL; Supplier 2: Mouser; Supplier Part Number 3: 9233504; Supplier 3: Farnell; RoHS: Y; Value1: 5%; MountType: SMT; Supplier 1: Digi-Key; PackageReference: 0603; Tolerance_%: 5%; Res_ohm: 10k; CompType: Resistor; PartNumber: RC0603JR-0710KL; ComponentLink1Description: Datasheet link; Supplier Part Number 1: 311-10KGRCT-ND; Technology: Thick Film; ComponentLink1URL: http://www.yageo.com/pdf/Pu-RC0603_51_PbFree_L_2.pdf; AEC Grade: N/A
R73 = CMP-0023000-5: RES, 2.00 k, 1%, 0.1 W, 0603; Manufacturer: Yageo; Power_W: 100mW; TempCo: 100 ppm/C; Value_Code: 2k00; Value: 2.00k; EIA_Code: E96; Res_ohm: 2k; SizeX_mm: 1.6; SizeY_mm: 0.8; SizeZ_mm: 1; Value2: 0.1W; SizeArea_mm2: 1.28; AEC Qualified: N; VDC_V: 75V; AEC Category: Q200; SizeAreaWB_mm2: 4.68; Supplier Part Number 2: 603-RC0603FR-072KL; Supplier 2: Mouser; Supplier Part Number 3: 1799328; Supplier 3: Farnell; RoHS: Y; Value1: 1%; MountType: SMT; Supplier 1: Digi-Key; PackageReference: 0603; Tolerance_%: 1%; CompType: Resistor; PartNumber: RC0603FR-072KL; ComponentLink1Description: Datasheet link; Supplier Part Number 1: 311-2.00KHRCT-ND; Technology: Thick Film; ComponentLink1URL: http://www.yageo.com/pdf/Pu-RC0603_51_PbFree_L_2.pdf; AEC Grade: N/A
R74 = CMP-0022364-4: RES, 38.3 k, 1%, 0.1 W, AEC-Q200 Grade 0, 0603; Manufacturer: Vishay-Dale; Value: 38.3k; Value_Code: 38k3; Power_W: 100mW; Value2: 0.1W; VDC_V: 75V; TempCo: 100 ppm/C; SizeArea_mm2: 1.28; SizeX_mm: 1.6; SizeY_mm: 0.8; SizeZ_mm: 1; EIA_Code: E96; AEC Category: Q200; AEC Qualified: Y; AEC Grade: 0; CompType: Resistor; PartNumber: CRCW060338K3FKEA; PackageReference: 0603; RoHS: E; Res_ohm: 38.3k; Tolerance_%: 1%; Value1: 1%; MountType: SMT; Technology: Thick Film; ComponentLink1Description: Datasheet link; ComponentLink1URL: http://www.vishay.com/docs/20035/dcrcwe3.pdf; Supplier 1: Digi-Key; Supplier Part Number 1: 541-38.3KHCT-ND; Supplier 2: Newark; Supplier Part Number 2: 52K8469; Supplier 3: Mouser; Supplier Part Number 3: 71-CRCW0603-38.3K-E3
R75 = CMP-0074664-1: RES, 0.007, 1%, 3 W, AEC-Q200 Grade 0, 2512; Manufacturer: Bourns; Value: 0.007; Res_ohm: 7m; Value_Code: 7L000; Power_W: 3W; TempCo: 50 ppm/C; EIA_Code: E96; U/M: EA; AEC Category: Q200; AEC Grade: 0; AEC Qualified: Y; Green_Lifecycle: Active; Green_REACh: Passed; SizeArea_mm2: 21.6075; SizeX_mm: 6.45; SizeY_mm: 3.35; SizeZ_mm: 0.9; CompType: Resistor; PartNumber: CRE2512-FZ-R007E-3; PackageReference: 2512; RoHS: Y; Tolerance_%: 1%; Value1: 1%; Value2: 3W; MountType: SMT; Technology: Metal Film; Published: 2008-06-26; Publisher: Texas Instruments; LatestRevisionDate: 2017-06-26; ComponentLink1Description: Datasheet link; ComponentLink1URL: http://www.bourns.com/docs/Product-Datasheets/CRE.pdf; Supplier 1: Digi-Key; Supplier Part Number 1: CRE2512-FZ-R007E-3CT-ND; Supplier 2: Newark; Supplier Part Number 2: 78X4876; Supplier 3: Mouser; Supplier Part Number 3: 652-CRE2512FZR007E-3; Green_EU RoHS-2: Incomplete; Green_EU RoHS: Passed
R76 R78 R79 R81 = CMP-0023155-5: RES, 4.99 k, 1%, 0.1 W, 0603; Manufacturer: Yageo; Value: 4.99k; Value_Code: 4k99; Power_W: 100mW; Value2: 0.1W; VDC_V: 75V; TempCo: 100 ppm/C; EIA_Code: E96; SizeArea_mm2: 1.28; SizeX_mm: 1.6; SizeY_mm: 0.8; SizeZ_mm: 1; AEC Category: Q200; AEC Qualified: N; SizeAreaWB_mm2: 4.68; CompType: Resistor; PartNumber: RC0603FR-074K99L; PackageReference: 0603; RoHS: Y; Res_ohm: 4.99k; Tolerance_%: 1%; Value1: 1%; MountType: SMT; Technology: Thick Film; ComponentLink1Description: Datasheet link; ComponentLink1URL: http://www.yageo.com/pdf/Pu-RC0603_51_PbFree_L_2.pdf; Supplier 1: Digi-Key; Supplier Part Number 1: 311-4.99KHRCT-ND; Supplier 2: Mouser; Supplier Part Number 2: 603-RC0603FR-074K99L; Supplier 3: Farnell; Supplier Part Number 3: 1799345; AEC Grade: N/A
R77 R80 R82 R83 = CMP-0022826-4: RES, 169 k, 1%, 0.1 W, 0603; Manufacturer: Yageo; Value: 169k; Power_W: 100mW; Value2: 0.1W; VDC_V: 75V; TempCo: 100 ppm/C; EIA_Code: E96; AEC Category: Q200; AEC Qualified: N; SizeArea_mm2: 1.28; SizeX_mm: 1.6; SizeY_mm: 0.8; SizeZ_mm: 1; SizeAreaWB_mm2: 4.68; CompType: Resistor; PartNumber: RC0603FR-07169KL; PackageReference: 0603; RoHS: Y; Res_ohm: 169k; Value_Code: 169k; Tolerance_%: 1%; Value1: 1%; MountType: SMT; Technology: Thick Film; ComponentLink1Description: Datasheet link; ComponentLink1URL: http://www.yageo.com/pdf/Pu-RC0603_51_PbFree_L_2.pdf; Supplier 1: Digi-Key; Supplier Part Number 1: 311-169KHRCT-ND; Supplier 2: Mouser; Supplier Part Number 2: 603-RC0603FR-07169KL; AEC Grade: N/A
SH-J1 = CMP-0003623-3: Shunt, 100mil, Gold plated, Black; Alternate PartNumber: 969102-0000-DA; Manufacturer: Samtec; Alternate Manufacturer: 3M; Value: 1x2; ComponentLink1URL: http://www.samtec.com/ftppub/pdf/SNT.PDF; Supplier 1: Digi-Key; CompType: Shunt; PackageReference: Shunt; ClassName: Shunt; RoHS: Y; Supplier Part Number 1: SAM8858-ND; MountType: N/A; PartNumber: SNT-100-BK-G; ComponentLink1Description: Datasheet Link
TP3 TP4 = CMP-0075110-1: 1mm Uninsulated Shorting Plug, 10.16mm spacing, TH; Manufacturer: Harwin; CompType: Jumper Wire; CNHeader: False; Green_Lifecycle: Active; Green_REACh: Passed; PartNumber: D3082-05; PackageReference: Shorting Plug, 10.16mm spacing, TH; RoHS: Y; MountType: TH; ComponentLink1Description: Datasheet URL; ComponentLink1URL: http://cdn.harwin.com/pdfs/D3080-D3083.pdf; Publisher: Texas Instruments; LatestRevisionDate: 2017-07-12; Supplier 1: Digi-Key; Supplier Part Number 1: 952-1873-ND; Supplier 2: Newark; Supplier Part Number 2: 01E9240; Supplier 3: Mouser; Supplier Part Number 3: 855-D3082-05; CT: False; Green_EU RoHS-2: Passed; Green_EU RoHS: Passed with Exemption
TP5-TP8 TP10 TP11 TP13-TP15 = CMP-0055139-1: Test Point, Miniature, White, TH; Manufacturer: Keystone; ContactFinish: Silver; CNHeader: FALSE; CT: TRUE; Green_Lifecycle: Active; Green_REACh: Passed; PartNumber: 5002; PackageReference: White Miniature Testpoint; CompType: Test Point; RoHS: Y; MountType: TH; ComponentLink1Description: Datasheet URL; ComponentLink1URL: http://www.keyelco.com/userAssets/file/M60-2p60.pdf; Publisher: Texas Instruments; LatestRevisionDate: 26/05/2017; Supplier 1: Digi-Key; Supplier Part Number 1: 36-5002-ND; Supplier 2: Newark; Supplier Part Number 2: 82H9632; Supplier 3: Mouser; Supplier Part Number 3: 534-5002; Color: White; Green_EU RoHS-2: Passed; Green_EU RoHS: Passed
TP9 = CMP-0055137-1: Test Point, Miniature, Red, TH; Manufacturer: Keystone; ContactFinish: Silver; CNHeader: FALSE; CT: TRUE; Green_Lifecycle: Active; Green_REACh: Passed; PartNumber: 5000; PackageReference: Red Miniature Testpoint; CompType: Test Point; RoHS: Y; MountType: TH; ComponentLink1Description: Datasheet URL; ComponentLink1URL: http://www.keyelco.com/userAssets/file/M60-2p60.pdf; Publisher: Texas Instruments; LatestRevisionDate: 26/05/2017; Supplier 1: Digi-Key; Supplier Part Number 1: 36-5000-ND; Supplier 2: Mouser; Supplier Part Number 2: 534-5000; Color: Red; Green_EU RoHS-2: Incomplete; Green_EU RoHS: Passed
TP12 = CMP-0055138-1: Test Point, Miniature, Black, TH; Manufacturer: Keystone; CNHeader: FALSE; Green_Lifecycle: Active; Green_REACh: Passed; ContactFinish: Silver; CT: TRUE; ComponentLink1URL: http://www.keyelco.com/userAssets/file/M60-2p60.pdf; Supplier Part Number 2: 534-5001; Publisher: Texas Instruments; Supplier 2: Mouser; Color: Black; RoHS: Y; MountType: TH; Green_EU RoHS-2: Incomplete; Supplier 1: Digi-Key; Green_EU RoHS: Passed; PackageReference: Black Miniature Testpoint; CompType: Test Point; LatestRevisionDate: 26/05/2017; PartNumber: 5001; ComponentLink1Description: Datasheet URL; Supplier Part Number 1: 36-5001-ND
U9 = CMP-0014024-2: 100-V Three-Phase Smart Gate Driver, RTV0032E (WQFN-32); Manufacturer: Texas Instruments; Alternate PartNumber: DRV8350SRTVT; SizeX_mm: 5; CompType: IC; SizeZ_mm: 0.8; SizeArea_mm2: 25; SizeAreaWB_mm2: 49; U/M: EA; PackageDescription: WQFN-32; PartNumber: DRV8350SRTVR; ComponentLink1URL: https://sps06.itg.ti.com/sites/KMS/crossdivteams/altium/docs/ComponentDatasheets/DRV835x_120116.pdf; ComponentLink1Description: Datasheet Link; LatestRevisionDate: 2017-03-09; SizeY_mm: 5; Publisher: Texas Instruments; PackageReference: RTV0032E; MountType: SMT; Alternate Manufacturer: Texas Instruments
U10 = CMP-0043121-2: ESD Solution for High-Speed Differential Interface, 4 Channels, -40 to +85 degC,10-pin SON (DQA), Green (RoHS & no Sb/Br); Manufacturer: Texas Instruments; IO Leakage Current(nA): 10; IO Capacitance(Typ)(pF): 0.8; 1394 / Firewire: TRUE; Breakdown Voltage(Min)(V): 9; Differential Capacitance(pF): 0.05; IEC 61000-4-2 Contact(+/- kV): 8; ComponentLink1URL: http://www.ti.com/; PackageDescription: 10-Pin Plastic Small Outline No-Lead, 1 x 2.5 x 0.55 mm Body, 0.5 mm Pitch; ComponentLink2URL: http://www.ti.com/general/docs/lit/getliterature.tsp?genericPartNumber=TPD4S010&fileType=pdf; Serial ATA / eSATA: TRUE; ComponentLink3Description: URL Link1; Eco-Plan: Green (RoHS & no Sb/Br); ComponentLink2Description: Datasheet; ComponentLink3URL: SamplesURL:http://www.ti.com/product/tpd4s010#samples; PackageReference: DQA0010A; DatasheetVersion: SLVS817E; SubFamily: ESD Solution; PartNumber: TPD4S010DQAR; PackageVersion: revB, Sep-2009; Mounting Technology: Surface Mount; ComponentLink1Description: Manufacturer URL; IEC 61000-4-2 Air-Gap(+/- kV): 9
U11 = CMP-0041014-2: 6.5 MHz, 585 uA, Rail-to-Rail I/O CMOS Operational Amplifier, 2.3 to 5.5 V, -40 to 125 degC, 5-pin SOT23 (DBV5), Green (RoHS & no Sb/Br); Manufacturer: Texas Instruments; CMRR(Min)(dB): 80; GBW(Typ)(MHz): 6.5; IIB(Max)(pA): 10; Iq per channel(Max)(mA): 0.75; Number of Channels: 1; Offset Drift(Typ)(uV/C): 3; Packing: SMALL T&R; Rating: Catalog; Slew Rate(Typ)(V/us): 5; Sub Family: High Output Current Amplifier (>=50mA), Low Input Bias Current Amp (<=10pA), Low Supply Voltage Amplifier (<=2.7V), Precision Amplifier; Total Supply Voltage(Max)(+5V is 5, +/-5V is 10): 5.5; Total Supply Voltage(Min)(+5V is 5, +/-5V is 10): 2.3; DatasheetVersion: SBOS279E; PackageVersion: 4073253-4/K, 03/2006; PackageReference: DBV0005A; PackageDescription: 5-Pin Plastic Small Outline, Body 1.6 x 2.9 mm, Pitch 0.95 mm; Eco-Plan: Green (RoHS & no Sb/Br); Vio (25C)(Max)(mV): 5; Code_JEDEC: MO-178; PartNumber: OPA374AIDBVT; ComponentLink1Description: Manufacturer URL; ComponentLink1URL: http://www.ti.com/; ComponentLink2Description: Datasheet; ComponentLink2URL: http://www.ti.com/lit/ds/symlink/opa374.pdf; ComponentLink3Description: Package Specification; ComponentLink3URL: http://www.ti.com/litv/pdf/mpds018i; Mounting Technology: Surface Mount